# EAGLE design imu-adapter-e407 (EAGLE 6.4)
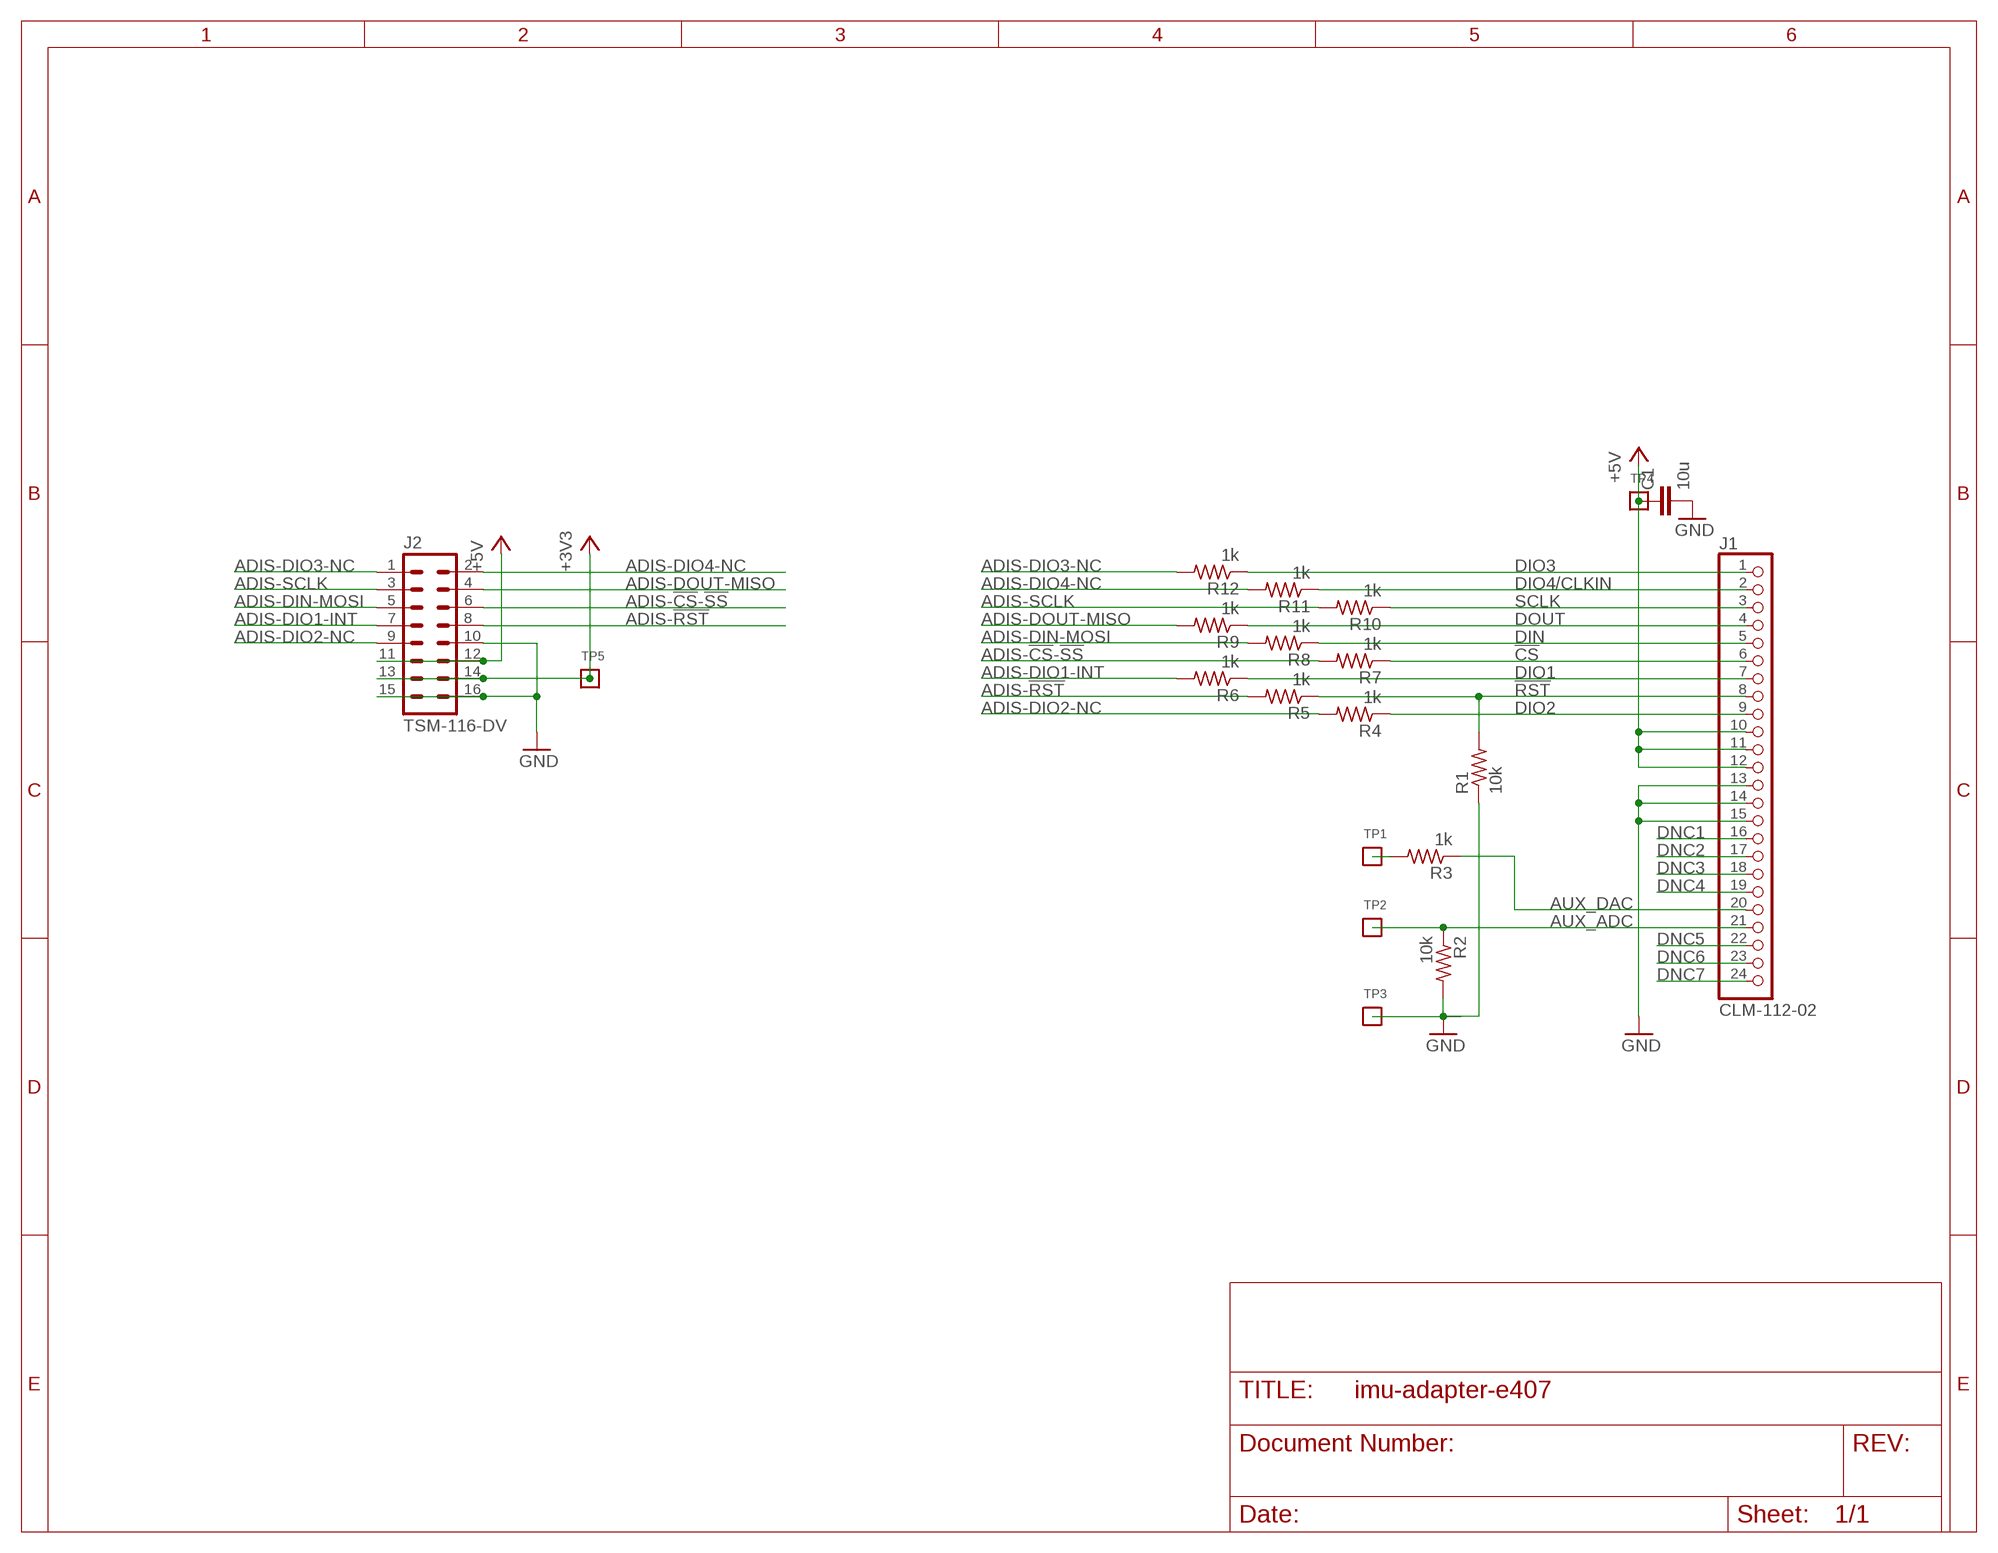
[diagram p0: schematic, sheet 1]

## Parts
C1  10u  C-EU0805-B-NOSILK  [0805-B-NOSILK]
J1  CLM-112-02  [CLM-112-02-XX-D-A]
J2  TSM-116-DV  [TSM-116-DV]
R1  10k  R-US_0603-B-NOSILK  [0603-B-NOSILK]
R2  10k  R-US_0603-B-NOSILK  [0603-B-NOSILK]
R3  1k  R-US_0603-B-NOSILK  [0603-B-NOSILK]
R4  1k  R-US_0603-B-NOSILK  [0603-B-NOSILK]
R5  1k  R-US_0603-B-NOSILK  [0603-B-NOSILK]
R6  1k  R-US_0603-B-NOSILK  [0603-B-NOSILK]
R7  1k  R-US_0603-B-NOSILK  [0603-B-NOSILK]
R8  1k  R-US_0603-B-NOSILK  [0603-B-NOSILK]
R9  1k  R-US_0603-B-NOSILK  [0603-B-NOSILK]
R10  1k  R-US_0603-B-NOSILK  [0603-B-NOSILK]
R11  1k  R-US_0603-B-NOSILK  [0603-B-NOSILK]
R12  1k  R-US_0603-B-NOSILK  [0603-B-NOSILK]
TP1  TEST-POINT  [2MM-TEST-POINT]
TP2  TEST-POINT  [2MM-TEST-POINT]
TP3  TEST-POINT  [2MM-TEST-POINT]
TP4  TEST-POINT  [2MM-TEST-POINT]
TP5  TEST-POINT  [2MM-TEST-POINT]

## Nets
!CS: J1.6 R7.1
!RST: J1.8 R1.2 R5.1
+3V3: J2.13 J2.14 TP5.1
+5V: C1.1 J1.10 J1.11 J1.12 J2.11 J2.12 TP4.1
ADIS-!CS!-!SS: J2.6 R7.2
ADIS-!RST: J2.8 R5.2
ADIS-DIN-MOSI: J2.5 R8.2
ADIS-DIO1-INT: J2.7 R6.2
ADIS-DIO2-NC: J2.9 R4.2
ADIS-DIO3-NC: J2.1 R12.2
ADIS-DIO4-NC: J2.2 R11.2
ADIS-DOUT-MISO: J2.4 R9.2
ADIS-SCLK: J2.3 R10.2
AUX_ADC: J1.21 R2.1 TP2.1
AUX_DAC: J1.20 R3.1
DIN: J1.5 R8.1
DIO1: J1.7 R6.1
DIO2: J1.9 R4.1
DIO3: J1.1 R12.1
DIO4/CLKIN: J1.2 R11.1
DNC1: J1.16
DNC2: J1.17
DNC3: J1.18
DNC4: J1.19
DNC5: J1.22
DNC6: J1.23
DNC7: J1.24
DOUT: J1.4 R9.1
GND: C1.2 J1.13 J1.14 J1.15 J2.10 J2.15 J2.16 R1.1 R2.2 TP3.1
N$1: R3.2 TP1.1
SCLK: J1.3 R10.1

## Library data of the parts
C1 = rcl_custom:C-EU: CAPACITOR, European symbol
J1 = samtec-clm-112-02:CLM-112-02: Samtec 24 pin (12x2) 1.0 mm connector
J2 = con-samtec:TSM-116-DV
R1-R12 = rcl_custom:R-US_: RESISTOR, American symbol
TP1-TP5 = Tova:TEST-POINT

## Board
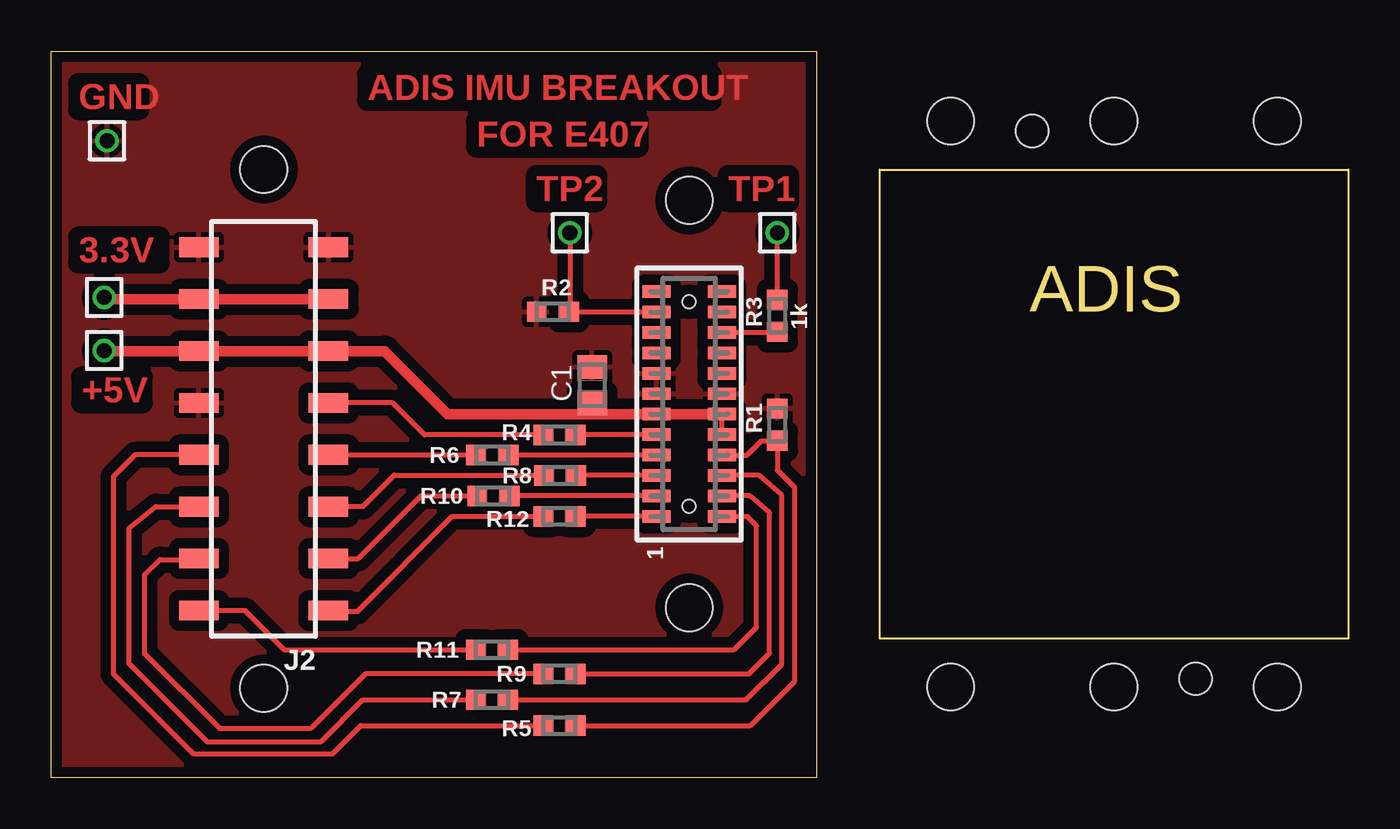
[diagram p1: board, top side]

Size 63.52 x 35.56 mm. Coordinates in mm from the lower left corner, seen from the top.
Outline: 0,0 0,35.56 37.47,35.56 37.47,0 0,0
Outline: 40.56,29.76 63.52,29.76 63.52,6.82 40.56,6.82 40.56,29.76
Copper layers (1*16): Top 0.0178mm / dielectric 59mil / Bottom 0.0178mm
Design rules "epl-lpkf": minimum track width 8mil, minimum drill 0.35mm, track to track 8mil, track to pad 8mil, pad to pad 8mil, via to via 8mil, smd to smd 8mil, copper to edge 15mil, drill to drill 15mil, minimum pad ring 8mil, minimum via ring 8mil, stop-mask expansion 3mil, vias tented up to drill 0mil, thermal gap 10mil
Holes 2.29 mm at 10.41,29.77 10.41,4.37 31.24,28.26 31.24,8.32 44.04,32.14 52.04,32.14 60.04,32.14 44.04,4.44 52.04,4.44 60.04,4.44
Holes 1.59 mm at 48.04,31.64 56.04,4.84

### Footprints (pad centres in the part's own frame; a part is rotated, then mirrored left to right if it is on the bottom)
0805-B-NOSILK = smd 1.15 x 1.45: 1 -0.9,0; 2 0.9,0
CLM-112-02-XX-D-A = smd 0.61 x 1.37: 1 -5.5,1.6; 2 -5.5,-1.6; 3 -4.5,1.6; 4 -4.5,-1.6; 5 -3.5,1.6; 6 -3.5,-1.6; 7 -2.5,1.6; 8 -2.5,-1.6; 9 -1.5,1.6; 10 -1.5,-1.6; 11 -0.5,1.6; 12 -0.5,-1.6; 13 0.5,1.6; 14 0.5,-1.6; 15 1.5,1.6; 16 1.5,-1.6; 17 2.5,1.6; 18 2.5,-1.6; 19 3.5,1.6; 20 3.5,-1.6; 21 4.5,1.6; 22 4.5,-1.6; 23 5.5,1.6; 24 5.5,-1.6 | hole 0.635: -5,0; 5,0
TSM-116-DV = smd 0.965 x 1.93: 1 -2.54,-3.175; 2 -2.54,3.175; 3 0,-3.175; 4 0,3.175; 5 2.54,-3.175; 6 2.54,3.175; 7 5.08,-3.175; 8 5.08,3.175; 9 7.62,-3.175; 10 7.62,3.175; 11 10.16,-3.175; 12 10.16,3.175; 13 12.7,-3.175; 14 12.7,3.175; 15 15.24,-3.175; 16 15.24,3.175
0603-B-NOSILK = smd 0.95 x 1: 1 -0.8,0; 2 0.8,0
2MM-TEST-POINT = drill 0.737: 1 0,0

### Placement (x,y rotation side)
C1  26.5,19.2 90 top
J1  31.24,18.29 90 top
J2  10.41,10.72 90 top
R1  35.56,17.27 270 top
R2  24.57,22.8 180 top
R3  35.56,22.61 90 top
R4  24.89,16.78 180 top
R5  24.89,2.54 180 top
R6  21.61,15.79 180 top
R7  21.59,3.81 180 top
R8  24.92,14.79 180 top
R9  24.89,5.08 180 top
R10  21.66,13.79 180 top
R11  21.59,6.26 180 top
R12  24.89,12.79 180 top
TP1  35.56,26.67 0 top
TP2  25.4,26.67 0 top
TP3  2.74,31.17 0 top
TP4  2.6,20.9 0 top
TP5  2.6,23.5 0 top

### Tracks (layer width: path | path; a pad name or v marks a point on that pad's centre or on a via)
!CS
  Top 0.254: J1.6 34.67,14.79 35.78,13.81 35.78,5.55 34.04,3.81 R7.1
!RST
  Top 0.254: J1.8 34.08,15.79 34.76,16.47 R1.2 35.56,15.04 36.42,14.18 36.42,4.73 34.24,2.54 R5.1
+3V3
  Top 0.508: TP5.1 2.68,23.42 J2.14 J2.13
+5V
  Top 0.254: J1.10 J1.12
  Top 0.508: J1.11 J1.12 | J1.11 19.42,17.79 16.33,20.88 J2.11 J2.12 2.62,20.88 TP4.1 | J1.11 27.01,17.79 C1.1
ADIS-!CS!-!SS
  Top 0.254: R7.2 15.27,3.81 13.19,1.73 7.67,1.73 3.81,5.59 3.81,12.19 5.08,13.21 5.13,13.26 J2.6
ADIS-!RST
  Top 0.254: R5.2 15.17,2.54 13.77,1.14 6.99,1.14 3.05,5.08 3.05,14.73 4.12,15.8 J2.8
ADIS-DIN-MOSI
  Top 0.254: R8.2 24.11,14.79 24.11,14.8 16.8,14.8 15.26,13.26 J2.5
ADIS-DIO1-INT
  Top 0.254: R6.2 13.97,15.79 | 13.97,15.79 13.59,15.79 | J2.7 13.97,15.8 13.97,15.79
ADIS-DIO2-NC
  Top 0.254: R4.2 18.29,16.78 16.73,18.34 J2.9
ADIS-DIO3-NC
  Top 0.254: 24.3,12.9 24.3,12.79 R12.2 19.65,12.79 14.99,8.13 13.64,8.13 J2.1
ADIS-DIO4-NC
  Top 0.254: R11.2 11.4,6.26 9.48,8.18 J2.2
ADIS-DOUT-MISO
  Top 0.254: R9.2 15.39,5.08 12.71,2.39 8.27,2.39 4.57,6.1 4.57,9.91 5.33,10.67 7.19,10.67 J2.4
ADIS-SCLK
  Top 0.254: R10.2 18.11,13.79 15.04,10.72 J2.3
AUX_ADC
  Top 0.254: J1.21 25.42,22.79 R2.1 25.4,22.83 TP2.1
AUX_DAC
  Top 0.254: J1.20 35.54,21.79 R3.1
DIN
  Top 0.254: J1.5 R8.1 | R8.1
DIO1
  Top 0.254: J1.7 R6.1
DIO2
  Top 0.254: J1.9 25.7,16.79 R4.1
DIO3
  Top 0.254: J1.1 R12.1
DIO4/CLKIN
  Top 0.254: J1.2 34.08,12.79 34.54,12.32 34.54,7.37 33.44,6.26 R11.1
DOUT
  Top 0.254: J1.4 34.22,13.79 35.18,12.95 35.18,6.1 34.16,5.08 R9.1
GND
  pour Top (isolate 0.508): 0,0 0,35.6 37.5,35.6 37.5,0
N$1
  Top 0.254: R3.2 TP1.1
SCLK
  Top 0.254: J1.3 R10.1

### Text on the board
Top: GND | ADIS IMU BREAKOUT | FOR E407 | TP2 | TP1 | 3.3V | +5V
Dimension: ADIS